# Altium schematic sheet QDRII_mem.SchDoc: QDRII_mem
size A4 portrait; Date: 18/06/2014; DrawnBy: J. Gabriel R.E.; Organization: Seven Solutions S.L.; Address1: C/Baza, Parcela 19, Nave 3; Address2: Polнgono Ind. Juncaril; Address3: 18210-Peligros-Granada; Address4: Spain; Revision: 3.4; SheetNumber: 20; SheetTotal: 23; WebAddress: www.sevensols.com; Project: White Rabbit; ProjectName: Project Name
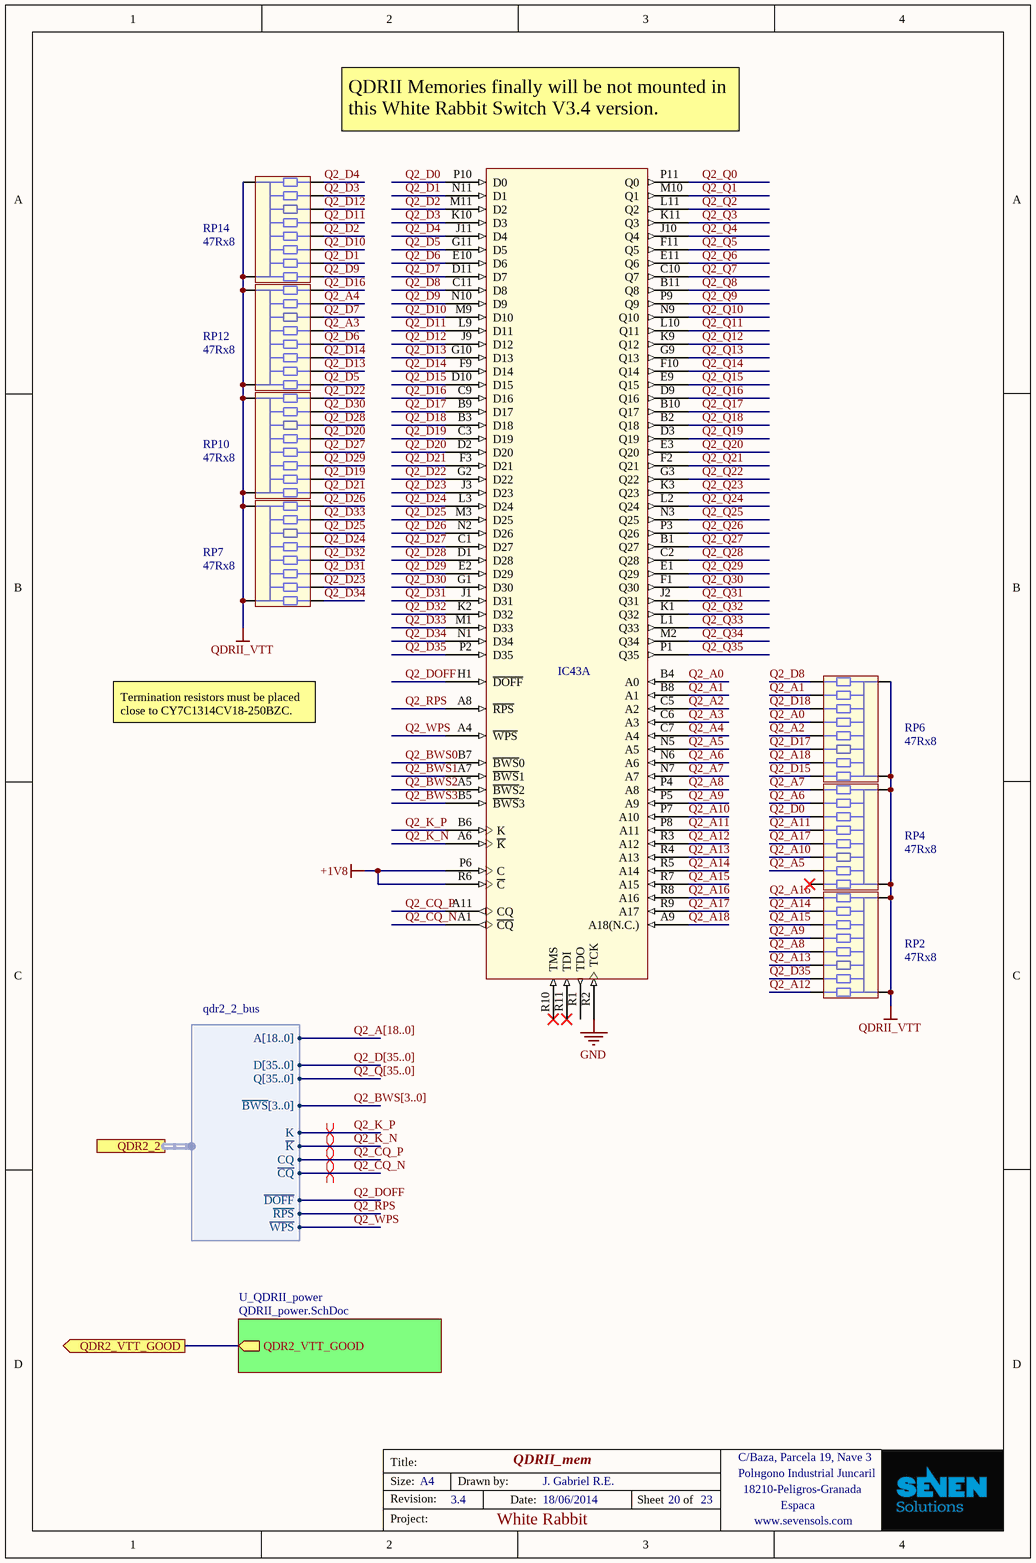
[diagram p0: QDRII_mem.SchDoc]

## Parts
IC43  CY7C1314KV18-250BZC  [BGA165C100P11X15_1300X1500X140]  (value not drawn)  (part A of 2)
RP2  value 47Rx8  [EXBE]  (hidden comment: 47R x 8)
RP4  value 47Rx8  [EXBE]  (hidden comment: 47R x 8)
RP6  value 47Rx8  [EXBE]  (hidden comment: 47R x 8)
RP7  value 47Rx8  [EXBE]  (hidden comment: 47R x 8)
RP10  value 47Rx8  [EXBE]  (hidden comment: 47R x 8)
RP12  value 47Rx8  [EXBE]  (hidden comment: 47R x 8)
RP14  value 47Rx8  [EXBE]  (hidden comment: 47R x 8)

## Sub-sheets
U_QDRII_power = QDRII_power.SchDoc: QDR2_VTT_GOOD (out)

## Ports
QDR2_2 (harness qdr2_2_bus), QDR2_VTT_GOOD (out)

## Harnesses
qdr2_2_bus: A[18..0], ~{BWS}[3..0], ~{CQ}, CQ, D[35..0], ~{DOFF}, K, ~{K}, Q[35..0], ~{RPS}, ~{WPS}

## Nets
+1V8: IC43.P6(C) IC43.R6(~{C})
GND: IC43.R2(TCK)
QDRII_VTT: RP2.1 RP2.6 RP4.1 RP4.6 RP6.1 RP6.6 RP7.1 RP7.6 RP10.1 RP10.6 RP12.1 RP12.6 RP14.1 RP14.6
Q2_A0: IC43.B4(A0) RP6.8
Q2_A1: IC43.B8(A1) RP6.10
Q2_A2: IC43.C5(A2) RP6.9
Q2_A3: IC43.C6(A3) RP12.7
Q2_A4: IC43.C7(A4) RP12.9
Q2_A5: IC43.N5(A5) RP4.8
Q2_A6: IC43.N6(A6) RP4.9
Q2_A7: IC43.N7(A7) RP4.10
Q2_A8: IC43.P4(A8) RP2.5
Q2_A9: IC43.P5(A9) RP2.8
Q2_A10: IC43.P7(A10) RP4.2
Q2_A11: IC43.P8(A11) RP4.3
Q2_A12: IC43.R3(A12) RP2.2
Q2_A13: IC43.R4(A13) RP2.4
Q2_A14: IC43.R5(A14) RP2.7
Q2_A15: IC43.R7(A15) RP2.9
Q2_A16: IC43.R8(A16) RP2.10
Q2_A17: IC43.R9(A17) RP4.4
Q2_A18: IC43.A9(A18(N.C.)) RP6.3
Q2_BWS0: IC43.B7(~{BWS}0)
Q2_BWS1: IC43.A7(~{BWS}1)
Q2_BWS2: IC43.A5(~{BWS}2)
Q2_BWS3: IC43.B5(~{BWS}3)
Q2_CQ_N: IC43.A1(~{CQ}) ; port QDR2_2.~{CQ}
Q2_CQ_P: IC43.A11(CQ) ; port QDR2_2.CQ
Q2_D0: IC43.P10(D0) RP4.5
Q2_D1: IC43.N11(D1) RP14.3
Q2_D2: IC43.M11(D2) RP14.5
Q2_D3: IC43.K10(D3) RP14.9
Q2_D4: IC43.J11(D4) RP14.10
Q2_D5: IC43.G11(D5) RP12.2
Q2_D6: IC43.E10(D6) RP12.5
Q2_D7: IC43.D11(D7) RP12.8
Q2_D8: IC43.C11(D8) RP6.5
Q2_D9: IC43.N10(D9) RP14.2
Q2_D10: IC43.M9(D10) RP14.4
Q2_D11: IC43.L9(D11) RP14.7
Q2_D12: IC43.J9(D12) RP14.8
Q2_D13: IC43.G10(D13) RP12.3
Q2_D14: IC43.F9(D14) RP12.4
Q2_D15: IC43.D10(D15) RP6.4
Q2_D16: IC43.C9(D16) RP12.10
Q2_D17: IC43.B9(D17) RP6.2
Q2_D18: IC43.B3(D18) RP6.7
Q2_D19: IC43.C3(D19) RP10.7
Q2_D20: IC43.D2(D20) RP10.9
Q2_D21: IC43.F3(D21) RP10.3
Q2_D22: IC43.G2(D22) RP10.5
Q2_D23: IC43.J3(D23) RP7.7
Q2_D24: IC43.L3(D24) RP7.10
Q2_D25: IC43.M3(D25) RP7.2
Q2_D26: IC43.N2(D26) RP7.4
Q2_D27: IC43.C1(D27) RP10.8
Q2_D28: IC43.D1(D28) RP10.10
Q2_D29: IC43.E2(D29) RP10.2
Q2_D30: IC43.G1(D30) RP10.4
Q2_D31: IC43.J1(D31) RP7.8
Q2_D32: IC43.K2(D32) RP7.9
Q2_D33: IC43.M1(D33) RP7.3
Q2_D34: IC43.N1(D34) RP7.5
Q2_D35: IC43.P2(D35) RP2.3
Q2_DOFF: IC43.H1(~{DOFF}) ; port QDR2_2.~{DOFF}
Q2_K_N: IC43.A6(~{K}) ; port QDR2_2.~{K}
Q2_K_P: IC43.B6(K) ; port QDR2_2.K
Q2_Q0: IC43.P11(Q0)
Q2_Q1: IC43.M10(Q1)
Q2_Q2: IC43.L11(Q2)
Q2_Q3: IC43.K11(Q3)
Q2_Q4: IC43.J10(Q4)
Q2_Q5: IC43.F11(Q5)
Q2_Q6: IC43.E11(Q6)
Q2_Q7: IC43.C10(Q7)
Q2_Q8: IC43.B11(Q8)
Q2_Q9: IC43.P9(Q9)
Q2_Q10: IC43.N9(Q10)
Q2_Q11: IC43.L10(Q11)
Q2_Q12: IC43.K9(Q12)
Q2_Q13: IC43.G9(Q13)
Q2_Q14: IC43.F10(Q14)
Q2_Q15: IC43.E9(Q15)
Q2_Q16: IC43.D9(Q16)
Q2_Q17: IC43.B10(Q17)
Q2_Q18: IC43.B2(Q18)
Q2_Q19: IC43.D3(Q19)
Q2_Q20: IC43.E3(Q20)
Q2_Q21: IC43.F2(Q21)
Q2_Q22: IC43.G3(Q22)
Q2_Q23: IC43.K3(Q23)
Q2_Q24: IC43.L2(Q24)
Q2_Q25: IC43.N3(Q25)
Q2_Q26: IC43.P3(Q26)
Q2_Q27: IC43.B1(Q27)
Q2_Q28: IC43.C2(Q28)
Q2_Q29: IC43.E1(Q29)
Q2_Q30: IC43.F1(Q30)
Q2_Q31: IC43.J2(Q31)
Q2_Q32: IC43.K1(Q32)
Q2_Q33: IC43.L1(Q33)
Q2_Q34: IC43.M2(Q34)
Q2_Q35: IC43.P1(Q35)
Q2_RPS: IC43.A8(~{RPS}) ; port QDR2_2.~{RPS}
Q2_WPS: IC43.A4(~{WPS}) ; port QDR2_2.~{WPS}
QDR2_VTT_GOOD: port QDR2_VTT_GOOD, sheet U_QDRII_power/QDR2_VTT_GOOD

Not connected (* = marked no-connect by the designer): IC43 R1(TDO) R10(TMS)* R11(TDI)*; RP4 7*

## Buses and harness runs
bus Q2_A[18..0]
bus Q2_BWS[3..0]
bus Q2_D[35..0]
bus Q2_Q[35..0]

## Layout directives
differential pair: Q2_CQ_N, Q2_CQ_P, Q2_K_N, Q2_K_P

## Notes on the sheet
- QDRII Memories finally will be not mounted in this White Rabbit Switch V3.4 version.
- Termination resistors must be placed close to CY7C1314CV18-250BZC.
- Title:
- Size:
- Revision:
- A4
- Drawn by:
- Date:
- Sheet
- of
- C/Baza, Parcela 19, Nave 3
- Polнgono Industrial Juncaril
- 18210-Peligros-Granada
- Espaсa
- Project:
- www.sevensols.com

## Library data of the parts
IC43 = CY7C1314CV18: 18-Mbit (512Kx36) QDRII SRAM 2-Word Burst Architecture; Value: CY7C1314KV18-250BZC; Distributor1 PN: CY7C1314KV18-250BZC-ND; Distributor1: Digikey
RP2 RP4 RP6 RP7 RP10 RP12 RP14 = EXB-E10C470J: 47R, 62.5mW Chip Resistor Bussed Network; Manufacturer1: Panasonic; Tolerance: ±5%; TCR: 200ppm; Case: EXBE; Manufacturer1 PN: EXB-E10C470J; Distributor1: DigiKey; Distributor1 PN: U8470CT-ND; Power Rating: 62.5mW